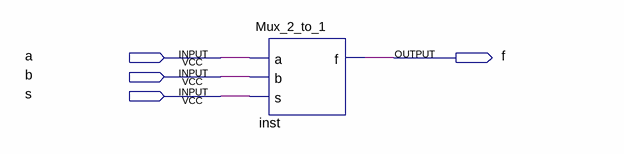
[diagram p0: schematic sheet]
// Quartus schematic Block1.bdf as structural Verilog: 1 symbols, 4 pins
module Block1 (
  input  a,
  input  b,
  input  s,
  output f
);

  Mux_2_to_1 inst (.a(a), .b(b), .s(s), .f(f));
endmodule
